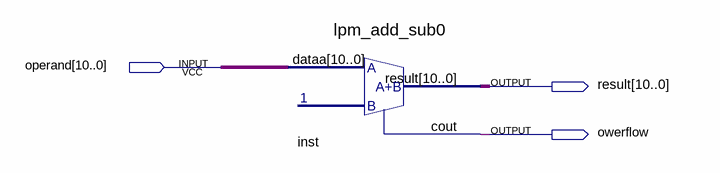
[diagram p0: schematic sheet]
// Quartus schematic INC.bdf as structural Verilog: 1 symbols, 3 pins
module INC (
  input  [10:0] operand,
  output [10:0] result,
  output owerflow
);

  lpm_add_sub0 inst (.dataa(operand), .result(result), .cout(owerflow));
endmodule
